# EAGLE design infnoise (EAGLE 7.1.0)
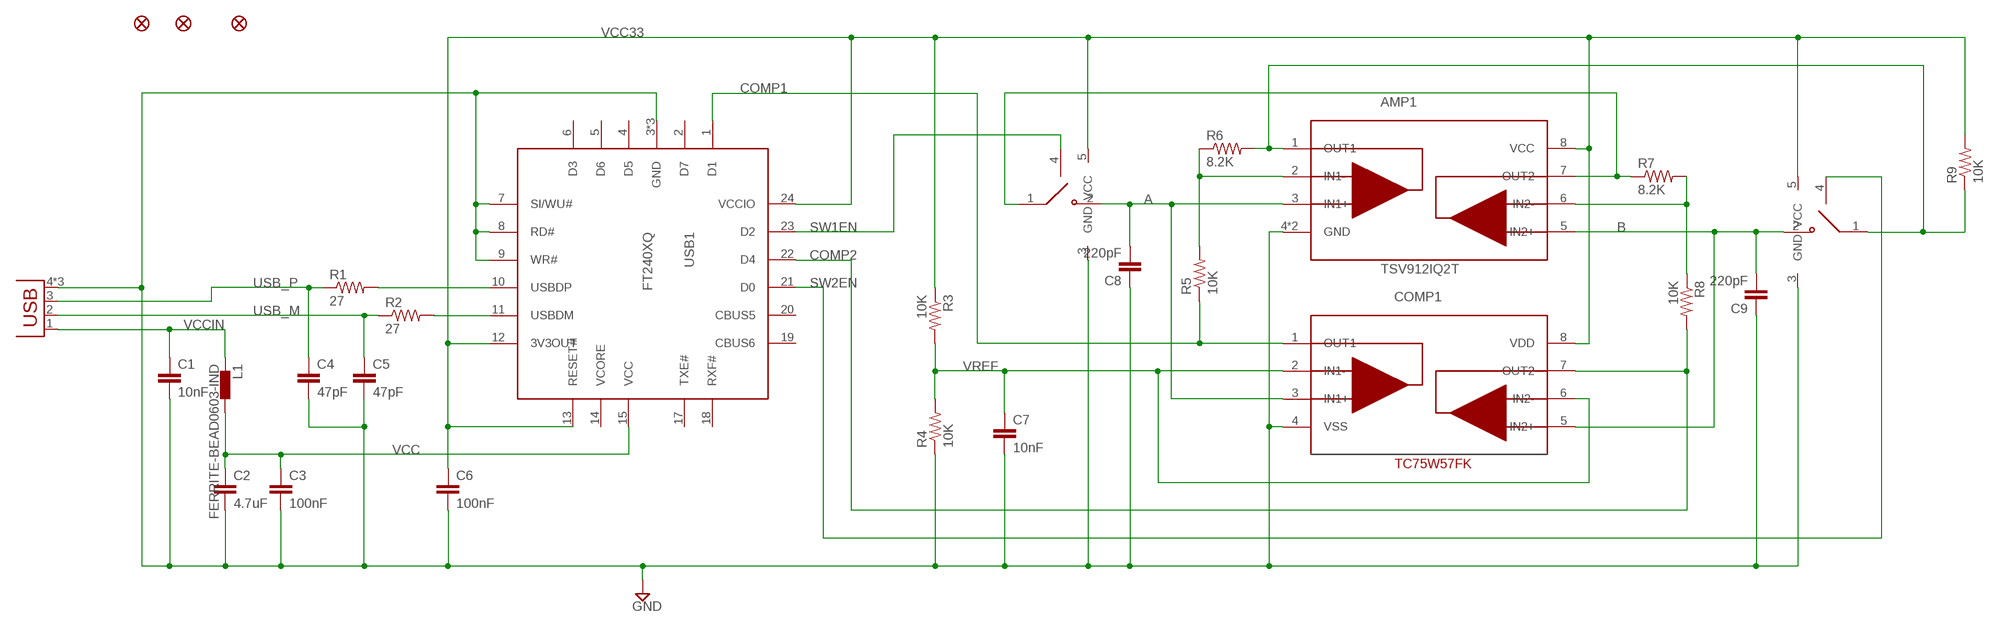
[diagram p0: schematic, sheet 1]

## Parts
AMP1  TSV912IQ2T  [DFN8-2X3]
C1  10nF  CAP0603-CAP  [0603-CAP]
C2  4.7uF  CAP0603-CAP  [0603-CAP]
C3  100nF  CAP0603-CAP  [0603-CAP]
C4  47pF  CAP0603-CAP  [0603-CAP]
C5  47pF  CAP0603-CAP  [0603-CAP]
C6  100nF  CAP0603-CAP  [0603-CAP]
C7  10nF  CAP0603-CAP  [0603-CAP]
C8  220pF  CAP0603-CAP  [0603-CAP]
C9  220pF  CAP0603-CAP  [0603-CAP]
COMP1  TC75W57FK  [SSOP8-P-0.50A]
FID1  FIDUCIALUFIDUCIAL  [MICRO-FIDUCIAL]
FID2  FIDUCIALUFIDUCIAL  [MICRO-FIDUCIAL]
FID3  FIDUCIALUFIDUCIAL  [MICRO-FIDUCIAL]
L1  FERRITE-BEAD0603-IND  [0603-IND]
R1  27  RESISTOR0603-RES  [0603-RES]
R2  27  RESISTOR0603-RES  [0603-RES]
R3  10K  RESISTOR0603-RES  [0603-RES]
R4  10K  RESISTOR0603-RES  [0603-RES]
R5  10K  RESISTOR0603-RES  [0603-RES]
R6  8.2K  RESISTOR0603-RES  [0603-RES]
R7  8.2K  RESISTOR0603-RES  [0603-RES]
R8  10K  RESISTOR0603-RES  [0603-RES]
R9  10K  RESISTOR0603-RES  [0603-RES]
SW1  MC74VHC1G66DFT1G  [SC70-5L]
SW2  MC74VHC1G66DFT1G  [SC70-5L]
USB1  FT240XQ  [QFN24-4X4]
X1  USBSMT-MALE  [USB-A-SMT-MALE]

## Nets
A: AMP1.3(IN1+) C8.2 COMP1.3(IN1+) SW1.2(NO)
AMP1OUT: AMP1.1(OUT1) R6.2 R9.1 SW2.1(COM)
AMP2OUT: AMP1.7(OUT2) R7.1 SW1.1(COM)
B: AMP1.5(IN2+) C9.2 COMP1.5(IN2+) SW2.2(NO)
COMP1: COMP1.1(OUT1) R5.1 USB1.1(D1)
COMP2: COMP1.7(OUT2) R8.2 USB1.22(D4)
FB1: AMP1.2(IN1-) R5.2 R6.1
FB2: AMP1.6(IN2-) R7.2 R8.1
GND: AMP1.4(GND) AMP1.EXP(GND) C1.2 C2.2 C3.2 C4.2 C5.2 C6.2 C7.2 C8.1 C9.1 COMP1.4(VSS) R4.1 SW1.3(GND) SW2.3(GND) USB1.3(GND) USB1.7(SI/WU#) USB1.8(RD#) USB1.9(WR#) USB1.16(GND) USB1.EXP(GND) X1.4(GND) X1.P$1(GND) X1.P$3(GND)
N$2: R1.2 USB1.10(USBDP)
SW1EN: SW1.4(IN) USB1.23(D2)
SW2EN: SW2.4(IN) USB1.21(D0)
USB_M: C5.1 R2.1 X1.2(D-)
USB_P: C4.1 R1.1 X1.3(D+)
USBDM: R2.2 USB1.11(USBDM)
VCC: C2.1 C3.1 L1.2 USB1.15(VCC)
VCC33: AMP1.8(VCC) C6.1 COMP1.8(VDD) R3.1 R9.2 SW1.5(VCC) SW2.5(VCC) USB1.12(3V3OUT) USB1.13(RESET#) USB1.24(VCCIO)
VCCIN: C1.1 L1.1 X1.1(VCC)
VREF: C7.1 COMP1.2(IN1-) COMP1.6(IN2-) R3.2 R4.2
Unconnected: USB1.2(D7) USB1.4(D5) USB1.5(D6) USB1.6(D3) USB1.14(VCORE) USB1.17(TXE#) USB1.18(RXF#) USB1.19(CBUS6) USB1.20(CBUS5)

## Library data of the parts
AMP1 = infnoise:TSV912: Cheap dual op-amp, rail-to-rail
C1-C9 = infnoise:CAP: Capacitor Standard 0603 ceramic capacitor, and 0.1" leaded capacitor.
COMP1 = infnoise:TC75W57: Dual comparator
FID1-FID3 = SparkFun-Aesthetics:FIDUCIAL: Fiducial Alignment Points Various fiducial points for machine vision alignment.
L1 = infnoise:FERRITE-BEAD: Chip Ferrite Bead for GHz Noise
R1-R9 = infnoise:RESISTOR: Resistor Basic schematic elements and footprints for 0603, 1206, and PTH resistors.
SW1 SW2 = infnoise:MC74VHC1G66: SPST (NO) Normally Open Analog Switch
USB1 = infnoise:FT240X: USB to FIFO interface chip
X1 = infnoise:USB: USB Connectors

## Board
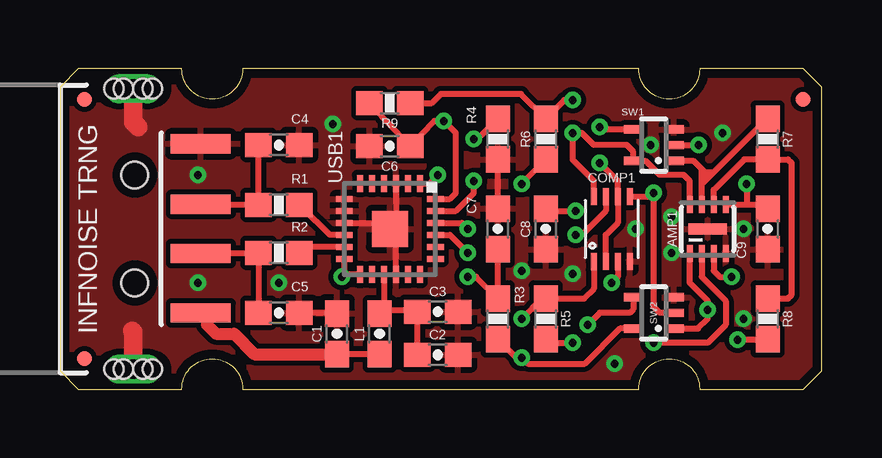
[diagram p1: board, top side]
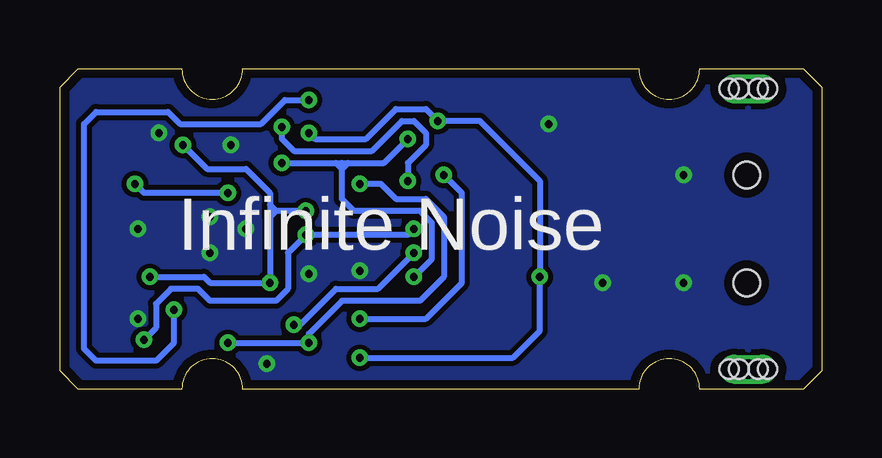
[diagram p2: board, bottom side, seen from below]

Size 31.75 x 13.36 mm. Coordinates in mm from the lower left corner, seen from the top.
Outline: 25.4,12.09 25.33,12.09
Outline: 25.4,12.09 arc90 26.67,13.36 30.99,13.36 31.75,12.6 31.75,0.76 30.99,0 26.67,0 arc90 25.4,1.27 arc90 24.13,0 7.62,0 arc90 6.35,1.27 arc90 5.08,0 0.76,0 0,0.76 0,12.6 0.76,13.36 5.08,13.36 arc90 6.35,12.09 arc90 7.62,13.36 24.13,13.36 arc90 25.4,12.09
Copper layers (1*16): Top 0.0356mm / dielectric 1.5011mm / Bottom 0.0356mm
Design rules "default *": minimum track width 8mil, minimum drill 13mil, track to track 8mil, track to pad 8mil, pad to pad 8mil, via to via 8mil, smd to smd 8mil, copper to edge 15mil, drill to drill 8mil, minimum pad ring 7mil, minimum via ring 7mil, stop-mask expansion 25mil, vias tented up to drill 14mil, thermal gap 10mil

### Footprints (pad centres in the part's own frame; a part is rotated, then mirrored left to right if it is on the bottom)
DFN8-2X3 = smd 0.25 x 0.7: 1 -0.75,-1.025; 2 -0.25,-1.025; 3 0.25,-1.025; 4 0.75,-1.025; 5 0.75,1.025; 6 0.25,1.025; 7 -0.25,1.025; 8 -0.75,1.025 | smd 1.6 x 0.45: EXP 0,0
0603-CAP = smd 1.1 x 1: 1 -0.85,0; 2 0.85,0
SSOP8-P-0.50A = smd 0.25 x 0.7: 1 -0.75,-1.35; 2 -0.25,-1.35; 3 0.25,-1.35; 4 0.75,-1.35; 5 0.75,1.35; 6 0.25,1.35; 7 -0.25,1.35; 8 -0.75,1.35
MICRO-FIDUCIAL = smd 0.635 x 0.635: 1 0,0
0603-IND = smd 1.1 x 1: 1 -0.85,0; 2 0.85,0
0603-RES = smd 1.1 x 1: 1 -0.85,0; 2 0.85,0
SC70-5L = smd 0.35 x 0.8: 1 -0.65,-0.85; 2 0,-0.85; 3 0.65,-0.85; 4 0.65,0.85; 5 -0.65,0.85
QFN24-4X4 = smd 0.7 x 0.25: 1 -1.9,1.25; 2 -1.9,0.75; 3 -1.9,0.25; 4 -1.9,-0.25; 5 -1.9,-0.75; 6 -1.9,-1.25; 13 1.9,-1.25; 14 1.9,-0.75; 15 1.9,-0.25; 16 1.9,0.25; 17 1.9,0.75; 18 1.9,1.25 | smd 0.25 x 0.7: 7 -1.25,-1.9; 8 -0.75,-1.9; 9 -0.25,-1.9; 10 0.25,-1.9; 11 0.75,-1.9; 12 1.25,-1.9; 19 1.25,1.9; 20 0.75,1.9; 21 0.25,1.9; 22 -0.25,1.9; 23 -0.75,1.9; 24 -1.25,1.9 | smd 1.5 x 1.5: EXP 0,0
USB-A-SMT-MALE = smd 0.8 x 2.5: 1 -3.5,-5.87; 2 -1.027,-5.87; 3 1.027,-5.87; 4 3.551,-5.87 | drill 0.8 pad 0.94 long: P$1 5.85,-3.05; P$3 -5.85,-3.05 | hole 1.1: 2.25,-3.12; -2.25,-3.12 | hole 0.8: -5.85,-3.45; -5.85,-3.85; -5.85,-2.65; -5.85,-2.25; 5.85,-3.45; 5.85,-3.85; 5.85,-2.65; 5.85,-2.25

### Placement (x,y rotation side)
AMP1  27,6.68 0 top
C1  11.55,2.31 90 top
C2  15.75,1.43 0 top
C3  15.75,3.23 0 top
C4  9.12,10.18 0 top
C5  9.12,3.18 0 top
C6  13.75,10.13 180 top
C7  18.25,6.68 90 top
C8  20.25,6.68 90 top
C9  29.5,6.68 90 top
COMP1  23,6.68 0 top
FID1  1.02,1.27 0 top
FID2  1.02,12.09 0 top
FID3  30.99,12.09 0 top
L1  13.32,2.31 90 top
R1  9.12,7.68 0 top
R2  9.12,5.68 0 top
R3  18.25,2.93 90 top
R4  18.25,10.43 90 top
R5  20.25,2.93 270 top
R6  20.25,10.43 90 top
R7  29.5,10.43 270 top
R8  29.5,2.93 270 top
R9  13.75,11.93 180 top
SW1  24.75,10.18 90 top
SW2  24.75,3.18 90 top
USB1  13.75,6.68 270 top
X1  0,6.68 90 top

### Tracks (layer width: path | path; a pad name or v marks a point on that pad's centre or on a via)
A  (via drill 0.33)
  Top 0.254: AMP1.3 27.25,4.93 27.5,4.68 v28,4.68 | SW1.2 v26.62,10.18 | COMP1.3 23.25,4.68 v23,4.43 | C8.2 20.35,7.43 v21.5,7.43
  Bottom 0.254: v26.62,10.18 25.62,9.18 24,9.18 23,8.18 23,7.68 | 23,7.68 23,7.43 | 23,7.43 23,7.18 | 23,7.18 v23,4.43 25.5,4.43 25.75,4.68 v28,4.68 | v21.5,7.43 22.75,7.43 | 22.75,7.43 23,7.43 | 22.75,7.43 23,7.68 | 22.75,7.43 23,7.18
AMP1OUT  (via drill 0.33)
  Top 0.254: SW2.1 26.6,2.53 27,2.93 v27,3.31 27,3.68 26.25,4.43 AMP1.1 | R9.1 15.5,11.93 15.88,12.3 19.23,12.3 R6.2 21.02,12.05 v21.38,12.05
  Bottom 0.254: v27,3.31 27,1.93 27.75,1.18 30.25,1.18 30.75,1.68 30.75,11.05 30.25,11.55 27.25,11.55 26.75,11.05 23.38,11.05 22.38,12.05 v21.38,12.05
AMP2OUT
  Top 0.254: AMP1.7 26.75,8.55 | 26.75,8.55 26.75,8.68 | 26.75,8.68 26.75,8.93 | 26.75,8.93 26.75,9.18 | 27.25,9.05 29.5,11.3 R7.1 | 27.25,9.05 27.12,8.93 | SW1.1 26.4,9.53 26.75,9.18 | 27.12,8.93 27,8.93 | 27,8.93 26.75,8.93 | 26.75,9.18 26.88,9.05 | 26.88,9.05 27,8.93 | 27,8.93 26.75,8.68 | 27.12,8.93 26.75,8.55 | 26.88,9.05 27.25,9.05
B  (via drill 0.33)
  Top 0.254: AMP1.5 28.62,7.71 | 28.62,7.71 29.32,7.71 C9.2 | COMP1.5 24.6,8.03 v24.75,8.18 24.75,3.43 25,3.18 SW2.2 | v28.62,8.55 28.62,7.71
  Bottom 0.254: v24.75,8.18 28.25,8.18 v28.62,8.55
COMP1  (via drill 0.33)
  Top 0.254: COMP1.1 22.25,4.18 21.85,3.78 R5.1 20.1,3.78 v19.25,2.93 | USB1.1 15.4,8.58 v15.75,8.93
  Bottom 0.254: v19.25,2.93 16.5,2.93 15,4.43 15,8.18 v15.75,8.93
COMP2  (via drill 0.33)
  Top 0.254: COMP1.7 22.75,7.43 21.75,6.43 v21.5,6.43 | USB1.22 16.75,6.93 v17,6.68 | R8.2 29.48,2.06 v28.25,2.06
  Bottom 0.254: v17,6.68 17.25,6.43 v21.5,6.43 22.25,5.68 22.25,4.18 22.75,3.68 25.5,3.68 26,4.18 27.12,4.18 27.75,3.56 27.75,2.56 v28.25,2.06
FB1  (via drill 0.33)
  Top 0.254: AMP1.2 26.75,4.68 27.75,3.68 27.75,2.68 27,1.93 v24.75,1.93 | R6.1 19.35,8.68 v19.25,8.55 | R5.2 20.52,1.93 v21.38,1.93 21.5,1.8
  Bottom 0.254: v19.25,8.55 18.38,8.55 17.75,7.93 16.5,7.93 15.75,7.18 15.75,4.68 16.75,3.68 20,3.68 21.38,2.31 v21.38,1.93 v24.75,1.93
FB2
  Top 0.254: AMP1.6 27.25,8.3 28.52,9.58 R7.2 30.35,9.58 30.5,9.43 30.5,3.93 30.35,3.78 R8.1
GND  (via drill 0.33)
  Top 0.254: USB1.16 14,6.43 USB1.EXP | USB1.3 14,6.93 USB1.EXP | C7.2 R4.1 | C1.2 11.35,3.18 C5.2 | USB1.9 13.5,6.93 USB1.EXP
  Top 0.762: X1.P$1 3.05,11.13 3.25,10.93 | X1.P$3 3.05,2.38 3,2.43
  other vias: 5.75,4.43 5.75,8.93 24,6.68 25.5,7.18 21.38,4.81 27.62,10.68 28.5,2.93 23.12,1.06 11.38,11.06 19.25,4.93 25.5,5.68 9.12,4.43 28.5,6.68 24.62,10.18
  pour Bottom: 0,13.43 0,-0.07 31.75,-0.07 31.75,13.43
  pour Top: 0,13.43 0,-0.07 31.75,-0.07 31.75,13.43
N$2
  Top 0.254: USB1.10 11.25,6.43 10.1,7.58 R1.2
SW1EN  (via drill 0.33)
  Top 0.254: USB1.23 16.5,7.43 17.25,8.18 v17.25,8.68 | SW1.4 22.6,10.83 v22.5,10.93
  Bottom 0.254: v17.25,8.68 17.25,9.43 16.5,10.18 16.5,10.68 17,11.18 17.5,11.18 18.75,9.93 22,9.93 22.5,10.43 v22.5,10.93
SW2EN  (via drill 0.33)
  Top 0.254: USB1.21 16.25,6.43 v17,5.68 | SW2.4 23.9,3.33 23.75,3.18 22.5,3.18 v22,2.68
  Bottom 0.254: v22,2.68 21.75,2.68 20.25,4.18 18.5,4.18 v17,5.68
USB_M
  Top 0.254: X1.2 5.9,5.68 R2.1 C5.1
USB_P
  Top 0.254: X1.3 8.37,7.71 | R1.1 C4.1
  Top 0.762: 8.37,7.71 R1.1
USBDM
  Top 0.254: USB1.11 10.35,5.93 R2.2
VCC
  Top 0.254: C2.1 C3.1 14.55,3.28 13.5,3.28 | 13.5,3.28 L1.2 | USB1.15 13.5,3.28
VCC33  (via drill 0.33)
  Top 0.254: R9.2 C6.1 15.6,11.18 v16,11.18 16.5,10.68 16.5,8.18 16.25,7.93 USB1.24 | USB1.12 11.85,4.78 | USB1.13 11.85,4.78 | 11.85,4.78 v11.75,4.68 | AMP1.8 26.25,8.68 26,8.93 25,8.93 24.4,9.53 SW1.5 23.9,9.9 23.62,10.18 22.25,10.18 21.75,10.68 v21.38,10.68 21.38,9.55 22.25,8.68 COMP1.8 | SW2.5 23.35,2.53 21.88,1.05 19.5,1.05 v19.25,1.3 19.02,1.3 R3.1
  Bottom 0.254: v19.25,1.3 12.88,1.3 11.75,2.43 v11.75,4.68 11.75,8.68 14.25,11.18 v16,11.18 16.5,11.68 17.75,11.68 19,10.43 21.12,10.43 v21.38,10.68
VCCIN
  Top 0.254: L1.1 C1.1
  Top 0.508: X1.1 6.12,2.92 6.12,2.68 6.5,2.31 7.25,2.31 8.1,1.46 C1.1
VREF  (via drill 0.33)
  Top 0.254: C7.1 R3.2 17.35,4.68 v17,4.68 | v22.5,9.43 23.25,8.68 COMP1.6 23.25,6.93 22.75,6.43 COMP1.2 | R4.2 17.4,10.43 v17.25,10.43
  Bottom 0.254: v17,4.68 16.25,5.43 16.25,6.93 16.75,7.43 19.5,7.43 20,7.93 20,9.18 | v22.5,9.43 20.25,9.43 | 20.25,9.43 20,9.43 | 20,9.43 19.75,9.43 | 19.75,9.43 18.25,9.43 v17.25,10.43 | 20,9.18 20,9.43 | 20,9.18 20.25,9.43 | 20,9.18 19.75,9.43

### Text on the board
tNames: INFNOISE TRNG
bNames: Infinite Noise